# Altium schematic sheet Power_Management.SchDoc (part 1 of 2)
size A3; SheetNumber: 3; SheetTotal: 4
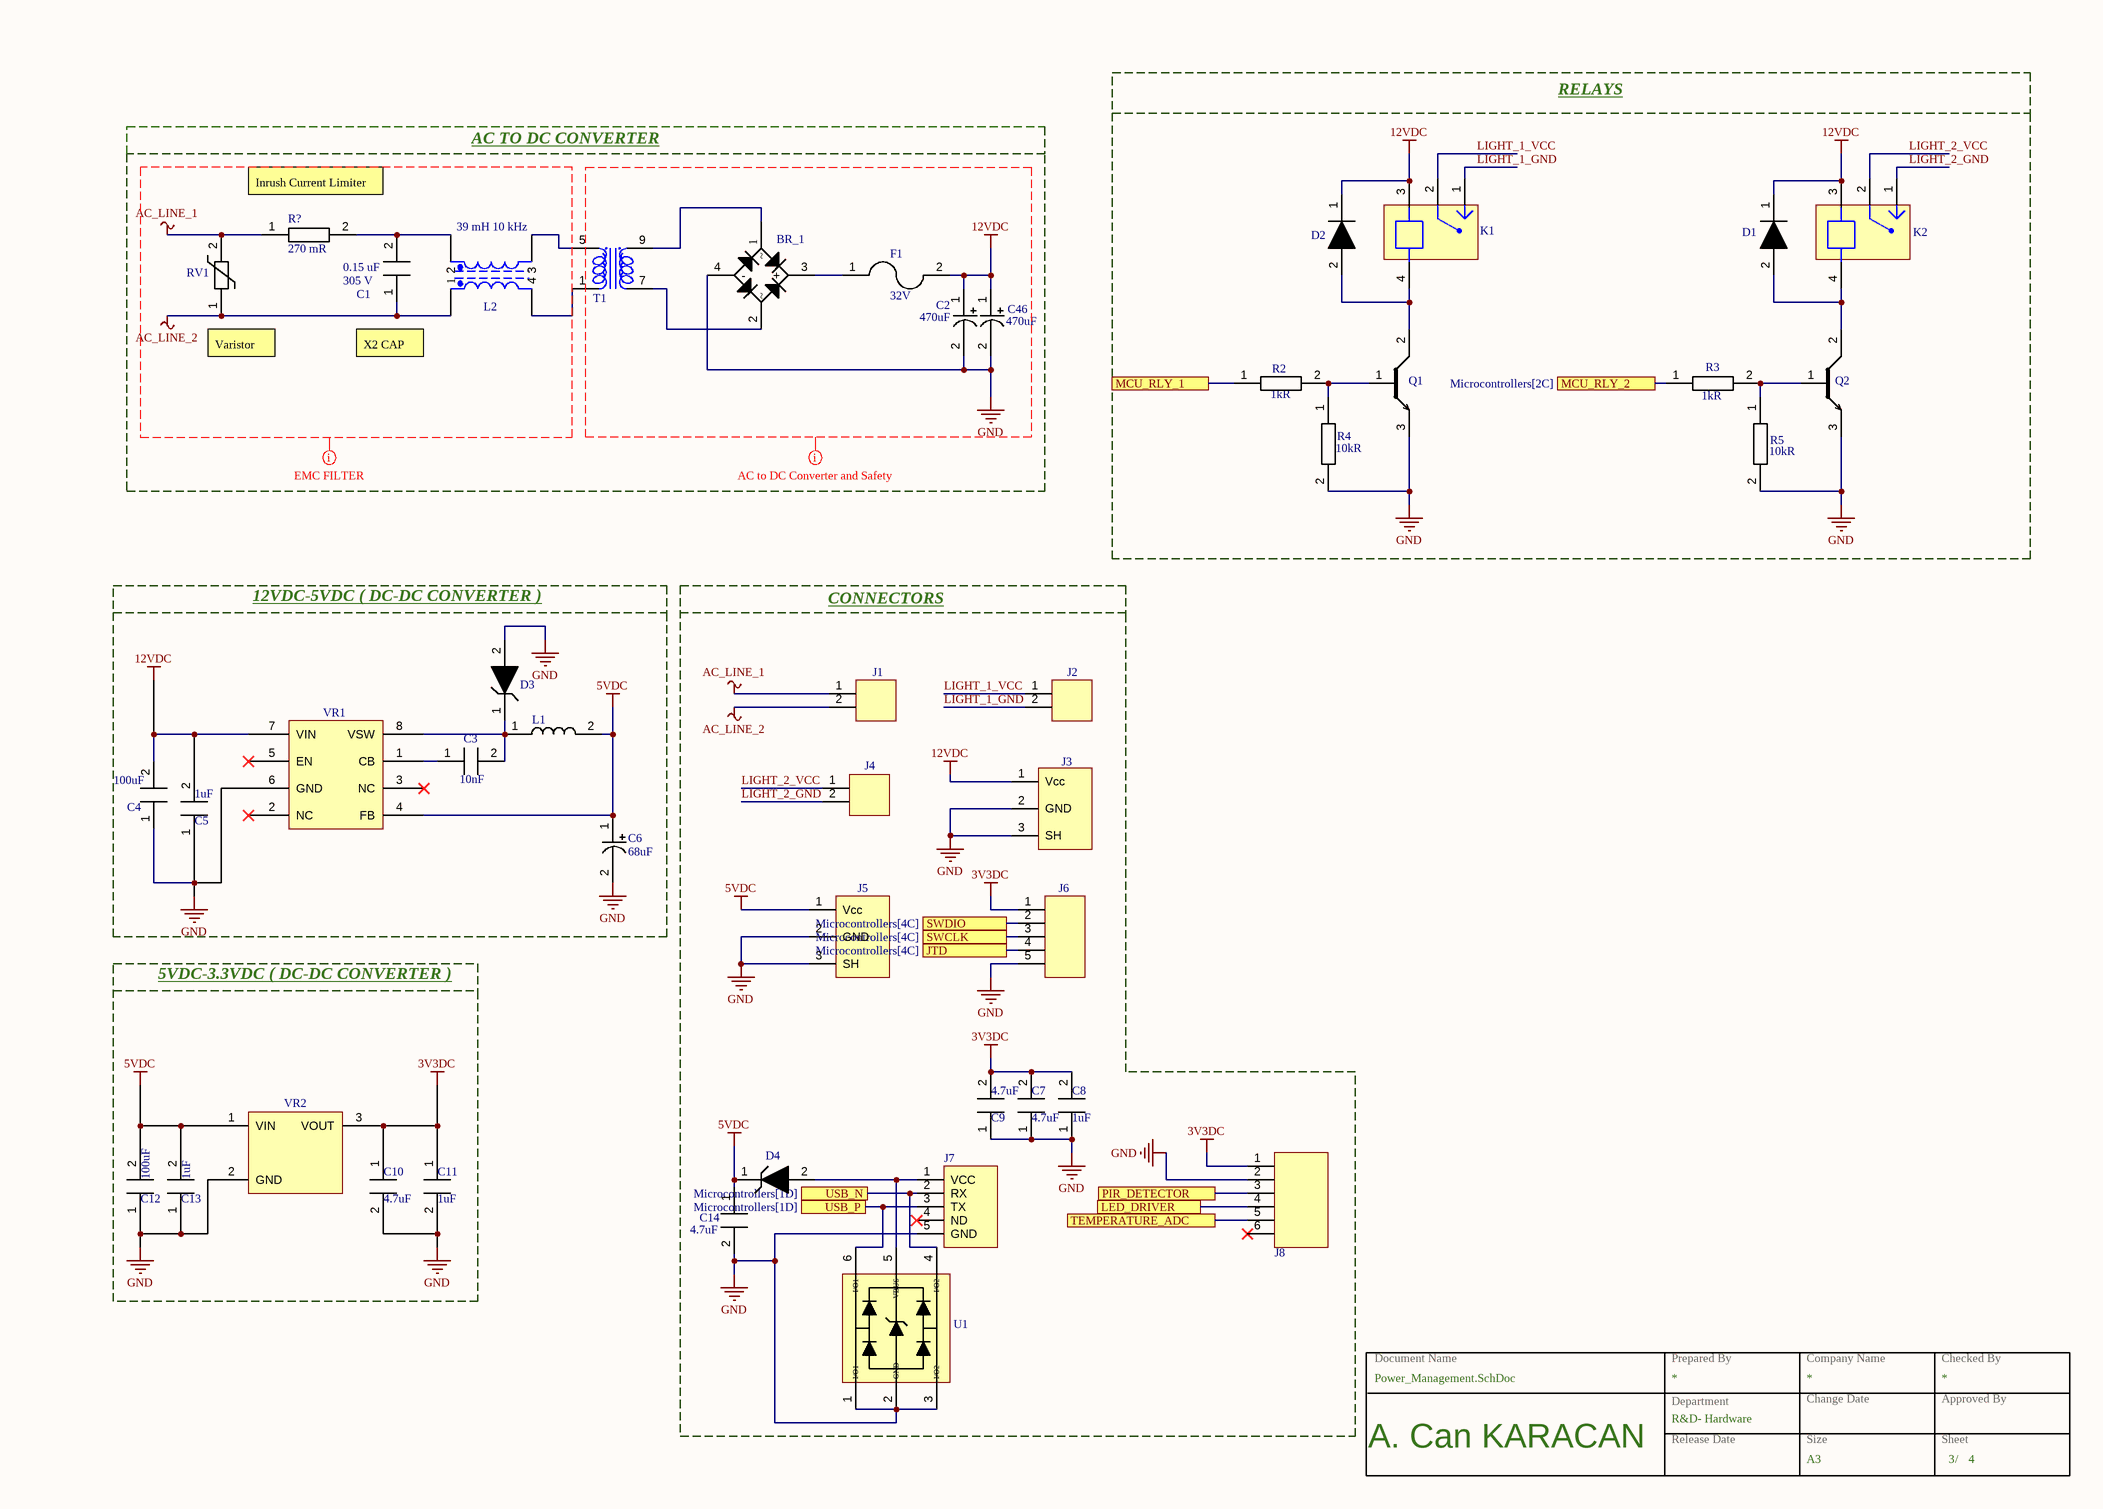
[diagram p0: Power_Management.SchDoc]

## Parts
BR_1  DB105S  [DB_S_SMD_4]  (value not drawn)
C1  value 0.15 uF  AC Voltage Rate: 305 V  [X2_CAP]  (hidden comment: MPX154K305E)
C2  value 470uF  [CAP_RADIAL_D10_P5]  (hidden comment: ESH477M050AH4AA)
C3  value 10nF  [CAP_0603]  (hidden comment: 0603B103K160CT)
C4  value 100uF  [CAP_0603]  (hidden comment: C1206C107M9PAC7800)
C5  value 1uF  [CAP_0805]  (hidden comment: CL21B105KBFNNNE)
C6  value 68uF  [CAP_EEVseries]  (hidden comment: EEV686M035A9HAA)
C7  value 4.7uF  [CAP_0805]  (hidden comment: CL21A475KAQNNNE)
C8  value 1uF  [CAP_0805]  (hidden comment: CL21B105KBFNNNE)
C9  value 4.7uF  [CAP_0805]  (hidden comment: CL21A475KAQNNNE)
C10  value 4.7uF  [CAP_0805]  (hidden comment: CL21A475KAQNNNE)
C11  value 1uF  [CAP_0805]  (hidden comment: CL21B105KBFNNNE)
C12  value 100uF  [CAP_0603]  (hidden comment: C1206C107M9PAC7800)
C13  value 1uF  [CAP_0805]  (hidden comment: CL21B105KBFNNNE)
C14  value 4.7uF  [CAP_0805]  (hidden comment: CL21A475KAQNNNE)
C46  value 470uF  [CAP_RADIAL_D10_P5]  (hidden comment: ESH477M050AH4AA)
D1  1N4148WS  [SOD_323_F]  (value not drawn)
D2  1N4148WS  [SOD_323_F]  (value not drawn)
D3  1SMB5919BT3G  [DO-214AA_SMB]  (value not drawn)
D4  1SMB5919BT3G  [DO-214AA_SMB]  (value not drawn)
F1  Voltage Rating: 32V  [FUSE_1206]  (hidden comment: 3413.0216.22)
J1  TBP01R1-508-02BE  [2P_5.08MM_MALE_CONN]  (value not drawn)
J2  TBP01R1-508-02BE  [2P_5.08MM_MALE_CONN]  (value not drawn)
J3  PJ-037AH-SMT-TR  [JACK]  (value not drawn)
J4  (no value)  [2P_5.08MM_MALE_CONN]
J5  PJ-037AH-SMT-TR  [JACK]  (value not drawn)
J6  SMH-105-02-L-S  [PINHEADER1X5_RA]  (value not drawn)
J7  10118192-0001LF  [MICRO_B_USB]  (value not drawn)
J8  64800611622  [6 HOLE CONNECTOR]  (value not drawn)
K1  K_ALQ312  [ALQ3]  (value not drawn)
K2  K_ALQ312  [ALQ3]  (value not drawn)
L1  78438335470  [IND_1212]  (value not drawn)
L2  39 mH 10 kHz  [CMC_B82732R2701B030]
Q1  MMBT3904-7-F  [SOT_23_3]  (value not drawn)
Q2  MMBT3904-7-F  [SOT_23_3]  (value not drawn)
R2  value 1kR  [RE_0603]  (hidden comment: RC0402FR-071KL)
R3  value 1kR  [RE_0603]  (hidden comment: RC0402FR-071KL)
R4  value 10kR  [RE_0402]  (hidden comment: RC0402JR-0710KL)
R5  value 10kR  [RE_0402]  (hidden comment: RC0402JR-0710KL)
R?  value 270 mR  [RES_AXIAL_W]  (hidden comment: 5WD27)
RV1  B72314P2301K101  (value not drawn)
T1  BV302S12010  [BV_302]  (value not drawn)
U1  USBLC6-2SC6  [SOT_23_6L]  (value not drawn)
VR1  LM2675MX-12/NOPB  [8_SOIC]  (value not drawn)
VR2  AP7361EA-33E-13  [SOT223]  (value not drawn)

## Blocks framed on the sheet
AC TO DC CONVERTER: BR_1 C1 C2 C46 F1 L2 R? RV1 T1

## Ports
JTD (see Microcontrollers[4C]), LED_DRIVER (see Microcontrollers[2C]), MCU_RLY_1 (see Microcontrollers[2C]), MCU_RLY_2 (see Microcontrollers[2C]), PIR_DETECTOR (see Microcontrollers[2C]), SWCLK (see Microcontrollers[4C]), SWDIO (see Microcontrollers[4C]), TEMPERATURE_ADC (see Microcontrollers[2D]), USB_N (see Microcontrollers[1D]), USB_P (see Microcontrollers[1D])

## Nets
3V3DC: C7.2 C8.2 C9.2 C10.1 C11.1 J6.1 J8.1 VR2.3(VOUT)
5VDC: C6.1 C12.2 C13.2 C14.1 D4.1 J5.1(Vcc) L1.2 VR1.4(FB) VR2.1(VIN)
12VDC: C2.1 C4.2 C5.2 C46.1 D1.1 D2.1 F1.2 J3.1(Vcc) K1.3 K2.3 VR1.7(VIN)
AC_LINE_1: J1.1 R?.1 RV1.2
AC_LINE_2: C1.1 J1.2 L2.1 RV1.1
GND: BR_1.4(-) C2.2 C4.1 C5.1 C6.2 C7.1 C8.1 C9.1 C10.2 C11.2 C12.1 C13.1 C14.2 C46.2 D3.2 J3.2(GND) J3.3(SH) J5.2(GND) J5.3(SH) J6.5 J7.5(GND) J8.2 Q1.3 Q2.3 R4.2 R5.2 U1.1(I/O1) U1.2(GND) U1.3(I/O2) VR1.6(GND) VR2.2(GND)
JTD: J6.4 ; port JTD
LED_DRIVER: J8.4 ; port LED_DRIVER
LIGHT_1_GND: J2.2 K1.1
LIGHT_1_VCC: J2.1 K1.2
LIGHT_2_GND: J4.2 K2.1
LIGHT_2_VCC: J4.1 K2.2
MCU_RLY_1: R2.1 ; port MCU_RLY_1
MCU_RLY_2: R3.1 ; port MCU_RLY_2
PIR_DETECTOR: J8.3 ; port PIR_DETECTOR
SWCLK: J6.3 ; port SWCLK
SWDIO: J6.2 ; port SWDIO
TEMPERATURE_ADC: J8.5 ; port TEMPERATURE_ADC
USB_N: J7.2(RX) U1.4(I/O2) ; port USB_N
USB_P: J7.3(TX) U1.6(I/O1) ; port USB_P
NetBR_1_1: BR_1.1 T1.9
NetBR_1_2: BR_1.2 T1.7
NetBR_1_3: BR_1.3(+) F1.1
NetC1_2: C1.2 L2.2 R?.2
NetC3_1: C3.1 VR1.1(CB)
NetC3_2: C3.2 D3.1 L1.1 VR1.8(VSW)
NetD1_2: D1.2 K2.4 Q2.2
NetD2_2: D2.2 K1.4 Q1.2
NetD4_2: D4.2 J7.1(VCC) U1.5(VBUS)
NetL2_3: L2.3 T1.5
NetL2_4: L2.4 T1.1
NetQ1_1: Q1.1 R2.2 R4.1
NetQ2_1: Q2.1 R3.2 R5.1

Not connected (* = marked no-connect by the designer): J7 4(ND)*; J8 6*; VR1 2(NC)* 3(NC)* 5(EN)*

## Layout directives
mark named EMC FILTER: AC_LINE_1, AC_LINE_2
mark named AC to DC Converter and Safety: 12VDC, GND

## Notes on the sheet
- RELAYS
- (near R?) Inrush Current Limiter
- (near RV1) Varistor
- X2 CAP
- 12VDC-5VDC ( DC-DC CONVERTER )
- CONNECTORS
- 5VDC-3.3VDC ( DC-DC CONVERTER )
- Document Name
- Prepared By
- Company Name
- Checked By
- A. Can KARACAN
- Release Date
- Department
- R&D- Hardware
- Size
- Change Date
- A3
- Approved By
- Sheet
- /